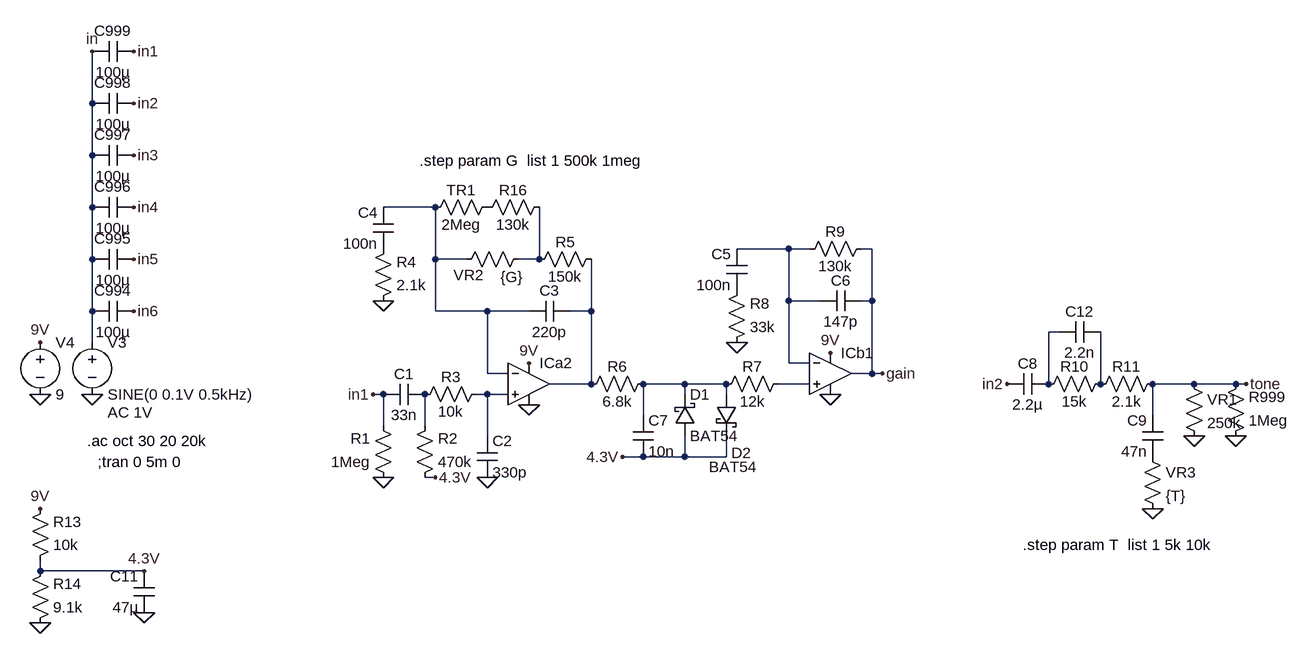
[diagram p0: schematic karen.asc]
karen.asc, the LTspice schematic file:
Version 4
SHEET 1 3148 2804
WIRE -2208 -256 -2208 -336
WIRE -2208 -176 -2208 -256
WIRE -2208 -96 -2208 -176
WIRE -1680 -96 -1760 -96
WIRE -1136 -32 -1216 -32
WIRE -1104 -32 -1136 -32
WIRE -1008 -32 -1024 -32
WIRE -2208 -16 -2208 -96
WIRE -1680 -16 -1680 -96
WIRE -1632 -16 -1680 -16
WIRE -1520 -16 -1520 -96
WIRE -1520 -16 -1552 -16
WIRE -1136 48 -1136 -32
WIRE -1088 48 -1136 48
WIRE -1008 48 -1008 -32
WIRE -1008 48 -1024 48
WIRE -2208 64 -2208 -16
WIRE -1680 64 -1680 -16
WIRE -1600 64 -1680 64
WIRE -1536 64 -1600 64
WIRE -1440 64 -1440 -16
WIRE -1440 64 -1472 64
WIRE -720 96 -736 96
WIRE -2208 112 -2208 64
WIRE -1136 144 -1136 48
WIRE -1104 144 -1136 144
WIRE -1600 160 -1600 64
WIRE -1568 160 -1600 160
WIRE -1008 160 -1008 48
WIRE -1008 160 -1040 160
WIRE -992 160 -1008 160
WIRE -1440 176 -1440 64
WIRE -1440 176 -1504 176
WIRE -1296 176 -1360 176
WIRE -1232 176 -1296 176
WIRE -1104 176 -1152 176
WIRE -736 176 -736 96
WIRE -656 176 -656 96
WIRE -512 176 -576 176
WIRE -448 176 -512 176
WIRE -432 176 -448 176
WIRE -1760 192 -1776 192
WIRE -1600 192 -1616 192
WIRE -1568 192 -1600 192
WIRE -1296 192 -1296 176
WIRE -1232 192 -1232 176
WIRE -1360 224 -1360 176
WIRE -576 224 -576 176
WIRE -1760 240 -1760 192
WIRE -1696 240 -1696 192
WIRE -1600 256 -1600 192
WIRE -1360 288 -1392 288
WIRE -1296 288 -1296 256
WIRE -1296 288 -1360 288
WIRE -1232 288 -1232 256
WIRE -1232 288 -1296 288
WIRE -1680 320 -1696 320
WIRE -2288 464 -2288 448
WIRE -2128 464 -2288 464
FLAG -2288 544 0
FLAG -2128 528 0
FLAG -2288 368 9V
FLAG -2128 464 4.3V
FLAG -1776 192 in1
FLAG -1536 144 9V
FLAG -1760 48 0
FLAG -1536 208 0
FLAG -576 368 0
FLAG -512 256 0
FLAG -448 256 0
FLAG -1760 320 0
FLAG -1600 320 0
FLAG -1680 320 4.3V
FLAG -1392 288 4.3V
FLAG -1072 128 9V
FLAG -1072 192 0
FLAG -1216 112 0
FLAG -432 176 tone
FLAG -2208 192 0
FLAG -2208 -336 in
FLAG -2288 192 0
FLAG -2288 112 9V
FLAG -2144 -336 in1
FLAG -2144 -256 in2
FLAG -2144 -176 in3
FLAG -2144 -96 in4
FLAG -2144 -16 in5
FLAG -2144 64 in6
FLAG -800 176 in2
FLAG -992 160 gain
SYMBOL res -2304 464 M180
WINDOW 0 36 76 Left 2
WINDOW 3 36 40 Left 2
SYMATTR InstName R13
SYMATTR Value 10k
SYMBOL res -2304 560 M180
WINDOW 0 36 76 Left 2
WINDOW 3 36 40 Left 2
SYMATTR InstName R14
SYMATTR Value 9.1k
SYMBOL cap -2112 528 R180
WINDOW 0 24 56 Left 2
WINDOW 3 24 8 Left 2
SYMATTR InstName C11
SYMATTR Value 47µ
SYMBOL res -1600 176 R90
WINDOW 0 5 56 VBottom 2
WINDOW 3 27 56 VTop 2
SYMATTR InstName R3
SYMATTR Value 10k
SYMBOL schottky -1312 256 M180
WINDOW 0 24 64 Left 2
WINDOW 3 24 0 Left 2
SYMATTR InstName D1
SYMATTR Value BAT54
SYMATTR Description Diode
SYMATTR Type diode
SYMBOL schottky -1248 192 R0
WINDOW 0 24 90 Left 2
WINDOW 3 -11 112 Left 2
SYMATTR InstName D2
SYMATTR Value BAT54
SYMATTR Description Diode
SYMATTR Type diode
SYMBOL cap -1616 320 M180
WINDOW 0 24 56 Left 2
WINDOW 3 24 8 Left 2
SYMATTR InstName C2
SYMATTR Value 330p
SYMBOL res -1744 336 R180
WINDOW 0 36 76 Left 2
WINDOW 3 36 40 Left 2
SYMATTR InstName R1
SYMATTR Value 1Meg
SYMBOL res -640 160 R90
WINDOW 0 5 56 VBottom 2
WINDOW 3 27 56 VTop 2
SYMATTR InstName R10
SYMATTR Value 15k
SYMBOL cap -736 160 R90
WINDOW 0 0 32 VBottom 2
WINDOW 3 32 32 VTop 2
SYMATTR InstName C8
SYMATTR Value 2.2µ
SYMBOL res -1536 -32 R90
WINDOW 0 56 93 VBottom 2
WINDOW 3 28 26 VTop 2
SYMATTR InstName VR2
SYMATTR Value {G}
SYMBOL res -1712 336 M180
WINDOW 0 36 76 Left 2
WINDOW 3 36 40 Left 2
SYMATTR InstName R2
SYMATTR Value 470k
SYMBOL cap -1696 176 R90
WINDOW 0 0 32 VBottom 2
WINDOW 3 32 32 VTop 2
SYMATTR InstName C1
SYMATTR Value 33n
SYMBOL res -1776 64 M180
WINDOW 0 36 76 Left 2
WINDOW 3 36 40 Left 2
SYMATTR InstName R4
SYMATTR Value 2.1k
SYMBOL cap -1744 -32 R180
WINDOW 0 24 56 Left 2
WINDOW 3 24 8 Left 2
SYMATTR InstName C4
SYMATTR Value 100n
SYMBOL cap -656 80 R90
WINDOW 0 0 32 VBottom 2
WINDOW 3 32 32 VTop 2
SYMATTR InstName C12
SYMATTR Value 2.2n
SYMBOL res -560 160 R90
WINDOW 0 5 56 VBottom 2
WINDOW 3 27 56 VTop 2
SYMATTR InstName R11
SYMATTR Value 2.1k
SYMBOL cap -560 288 R180
WINDOW 0 24 56 Left 2
WINDOW 3 24 8 Left 2
SYMATTR InstName C9
SYMATTR Value 47n
SYMBOL res -592 272 R0
SYMATTR InstName VR3
SYMATTR Value {T}
SYMBOL res -528 160 R0
SYMATTR InstName VR1
SYMATTR Value 250k
SYMBOL res -464 272 M180
WINDOW 0 36 76 Left 2
WINDOW 3 36 40 Left 2
SYMATTR InstName R999
SYMATTR Value 1Meg
SYMBOL cap -1472 48 R90
WINDOW 0 0 32 VBottom 2
WINDOW 3 32 32 VTop 2
SYMATTR InstName C3
SYMATTR Value 220p
SYMBOL res -1424 -32 R90
WINDOW 0 5 56 VBottom 2
WINDOW 3 27 56 VTop 2
SYMATTR InstName R5
SYMATTR Value 150k
SYMBOL res -1584 -112 R90
WINDOW 0 5 56 VBottom 2
WINDOW 3 27 56 VTop 2
SYMATTR InstName TR1
SYMATTR Value 2Meg
SYMBOL res -1504 -112 R90
WINDOW 0 5 56 VBottom 2
WINDOW 3 27 56 VTop 2
SYMATTR InstName R16
SYMATTR Value 130k
SYMBOL res -1344 160 R90
WINDOW 0 5 56 VBottom 2
WINDOW 3 27 56 VTop 2
SYMATTR InstName R6
SYMATTR Value 6.8k
SYMBOL cap -1376 288 M180
WINDOW 0 24 56 Left 2
WINDOW 3 24 8 Left 2
SYMATTR InstName C7
SYMATTR Value 10n
SYMBOL res -1136 160 R90
WINDOW 0 5 56 VBottom 2
WINDOW 3 27 56 VTop 2
SYMATTR InstName R7
SYMATTR Value 12k
SYMBOL cap -1024 32 R90
WINDOW 0 0 32 VBottom 2
WINDOW 3 32 32 VTop 2
SYMATTR InstName C6
SYMATTR Value 147p
SYMBOL res -1008 -48 R90
WINDOW 0 5 56 VBottom 2
WINDOW 3 27 56 VTop 2
SYMATTR InstName R9
SYMATTR Value 130k
SYMBOL res -1232 128 M180
WINDOW 0 36 76 Left 2
WINDOW 3 36 40 Left 2
SYMATTR InstName R8
SYMATTR Value 33k
SYMBOL cap -1200 32 R180
WINDOW 0 24 56 Left 2
WINDOW 3 24 8 Left 2
SYMATTR InstName C5
SYMATTR Value 100n
SYMBOL voltage -2208 96 R0
WINDOW 123 24 124 Left 2
WINDOW 39 0 0 Left 2
SYMATTR Value2 AC 1V
SYMATTR InstName V3
SYMATTR Value SINE(0 0.1V 0.5kHz)
SYMBOL voltage -2288 96 R0
WINDOW 123 0 0 Left 0
WINDOW 39 0 0 Left 0
SYMATTR InstName V4
SYMATTR Value 9
SYMBOL cap -2144 -272 R90
WINDOW 0 0 32 VBottom 2
WINDOW 3 32 32 VTop 2
SYMATTR InstName C998
SYMATTR Value 100µ
SYMBOL cap -2144 -192 R90
WINDOW 0 0 32 VBottom 2
WINDOW 3 32 32 VTop 2
SYMATTR InstName C997
SYMATTR Value 100µ
SYMBOL cap -2144 -112 R90
WINDOW 0 0 32 VBottom 2
WINDOW 3 32 32 VTop 2
SYMATTR InstName C996
SYMATTR Value 100µ
SYMBOL cap -2144 -352 R90
WINDOW 0 0 32 VBottom 2
WINDOW 3 32 32 VTop 2
SYMATTR InstName C999
SYMATTR Value 100µ
SYMBOL cap -2144 -32 R90
WINDOW 0 0 32 VBottom 2
WINDOW 3 32 32 VTop 2
SYMATTR InstName C995
SYMATTR Value 100µ
SYMBOL cap -2144 48 R90
WINDOW 0 0 32 VBottom 2
WINDOW 3 32 32 VTop 2
SYMATTR InstName C994
SYMATTR Value 100µ
SYMBOL Opamps\\UniversalOpamp2 -1072 160 R0
SYMATTR InstName ICb1
SYMBOL Opamps\\UniversalOpamp2 -1536 176 R0
SYMATTR InstName ICa2
TEXT -2216 264 Left 2 !.ac oct 30 20 20k
TEXT -2200 296 Left 2 !;tran 0 5m 0
TEXT -1704 -168 Left 2 !.step param G  list 1 500k 1meg
TEXT -776 424 Left 2 !.step param T  list 1 5k 10k

The netlist it stands for:
* karen.asc
R13 4.3V 9V 10k
R14 0 4.3V 9.1k
C11 0 4.3V 47µ
R3 N009 N010 10k
D1 4.3V N006 BAT54
D2 N006 4.3V BAT54
C2 0 N009 330p
R1 0 in1 1Meg
R10 N008 N005 15k
C8 N005 in2 2.2µ
R§VR2 N003 N001 {G}
R2 4.3V N010 470k
C1 N010 in1 33n
R4 0 P001 2.1k
C4 P001 N001 100n
C12 N008 N005 2.2n
R11 tone N008 2.1k
C9 P002 tone 47n
R§VR3 P002 0 {T}
R§VR1 tone 0 250k
R999 0 tone 1Meg
C3 N004 N001 220p
R5 N004 N003 150k
R§TR1 P003 N001 2Meg
R16 N003 P003 130k
R6 N006 N004 6.8k
C7 4.3V N006 10n
R7 N007 N006 12k
C6 gain N002 147p
R9 gain N002 130k
R8 0 P004 33k
C5 P004 N002 100n
V3 in 0 SINE(0 0.1V 0.5kHz) AC 1V
V4 9V 0 9
C998 in2 in 100µ
C997 in3 in 100µ
C996 in4 in 100µ
C999 in1 in 100µ
C995 in5 in 100µ
C994 in6 in 100µ
XICb1 N007 N002 9V 0 gain level.2 Avol=1Meg GBW=10Meg Slew=10Meg ilimit=25m rail=0 Vos=0 phimargin=45 en=0 enk=0 in=0 ink=0 Rin=500Meg  ; pins IN+ IN- V+ V- OUT
XICa2 N009 N001 9V 0 N004 level.2 Avol=1Meg GBW=10Meg Slew=10Meg ilimit=25m rail=0 Vos=0 phimargin=45 en=0 enk=0 in=0 ink=0 Rin=500Meg  ; pins IN+ IN- V+ V- OUT
.model D D
.lib standard.dio
.ac oct 30 20 20k
;tran 0 5m 0
.step param G  list 1 500k 1meg
.step param T  list 1 5k 10k
.lib UniversalOpamps2.sub
.backanno
.end